# EAGLE design untitled (EAGLE 9.2.2)
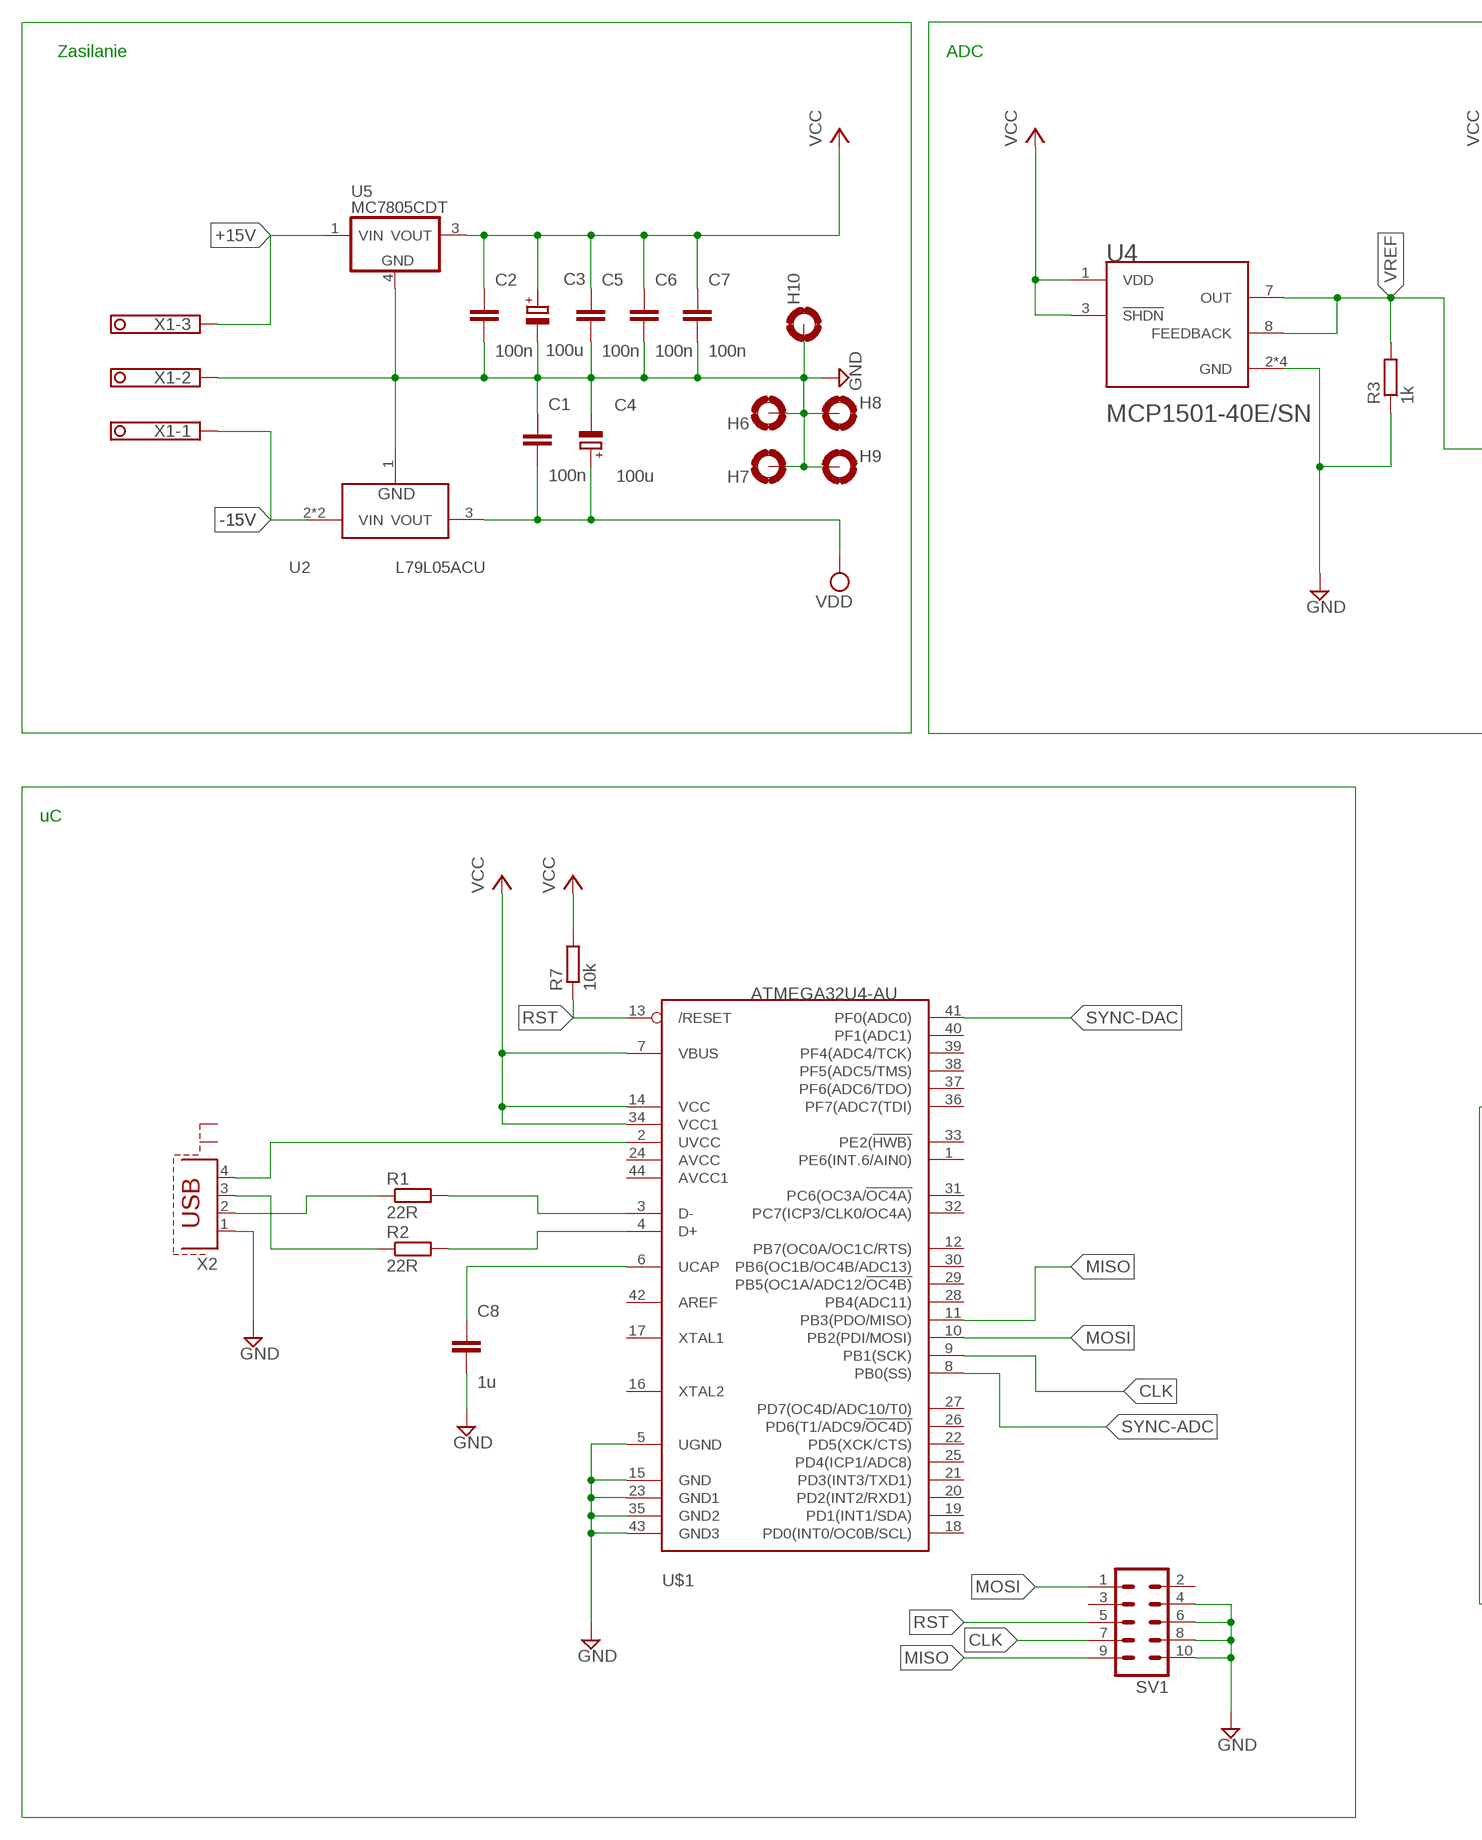
[diagram p0: schematic, sheet 1, part 1 of 2]
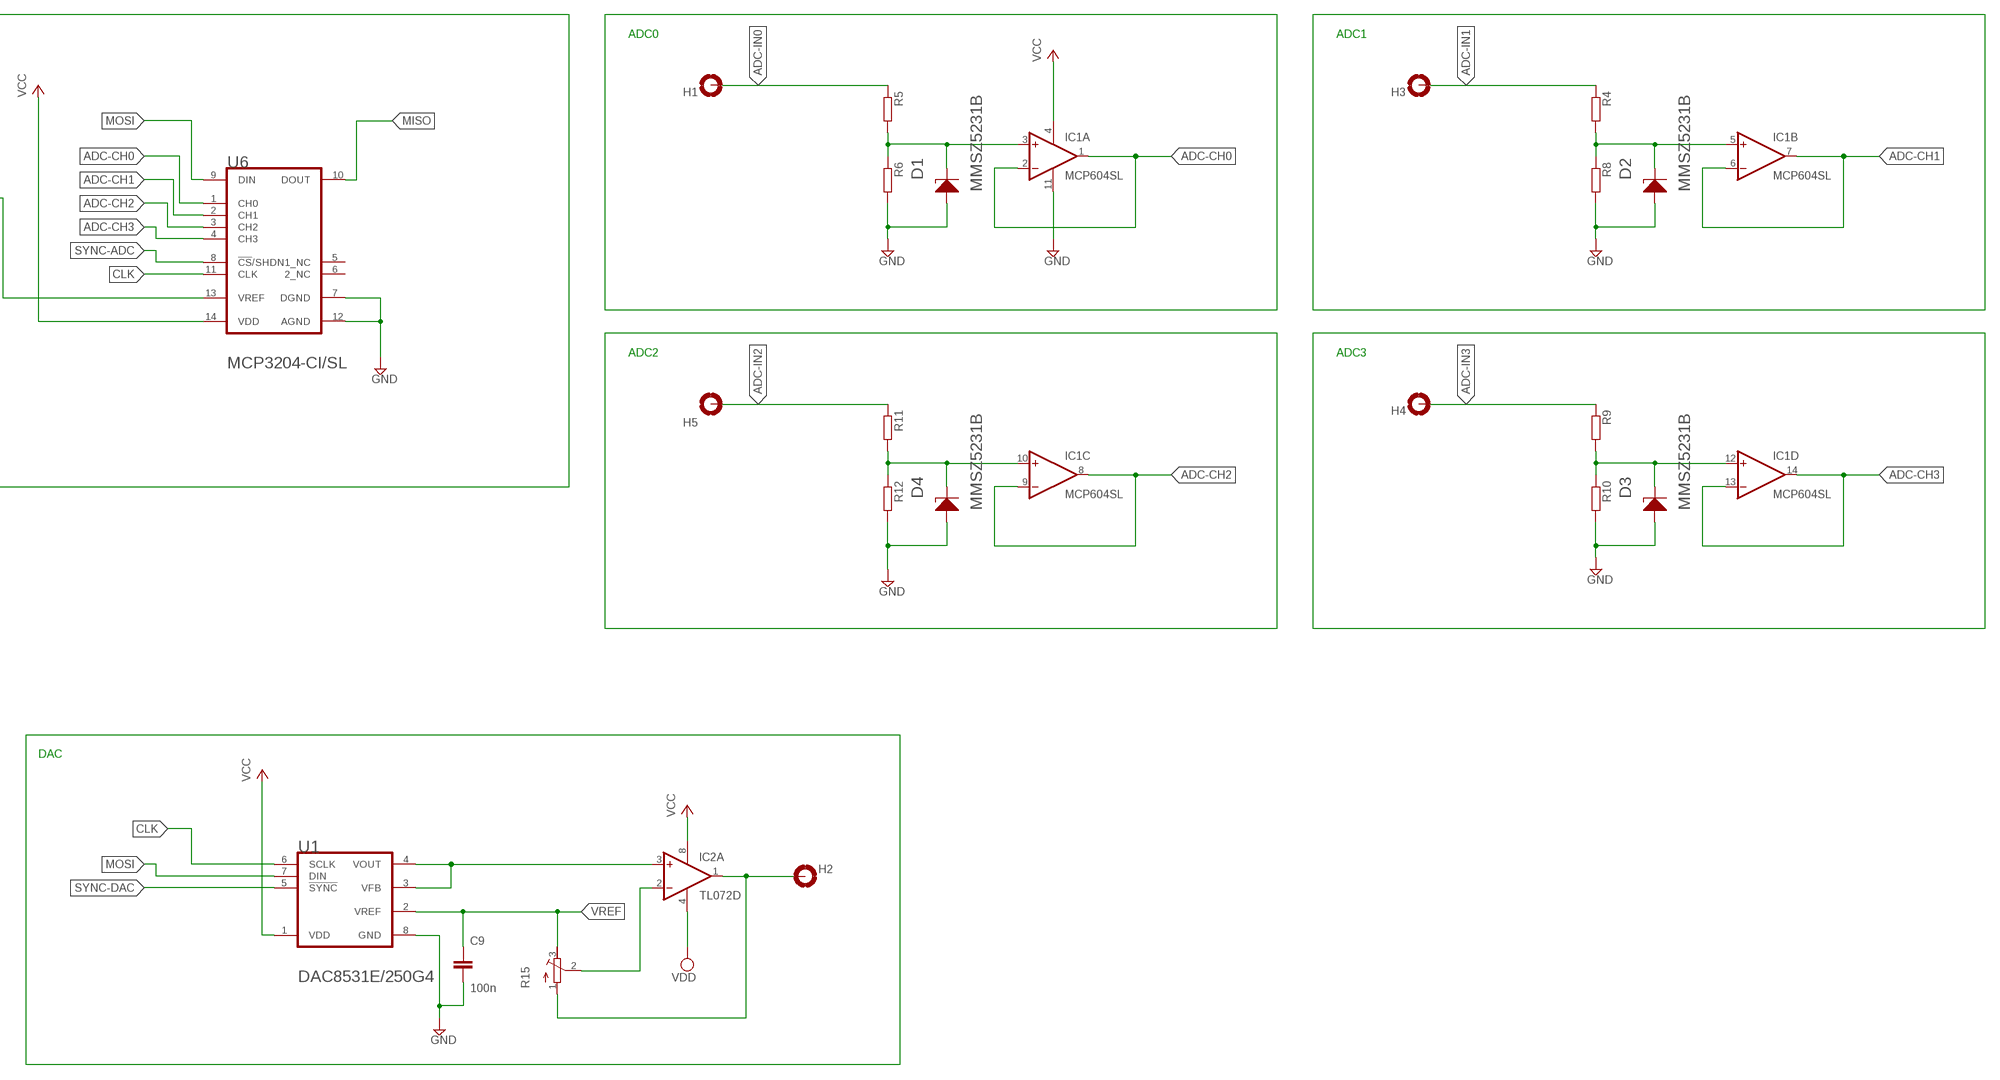
[diagram p1: schematic, sheet 1, part 2 of 2]

## Parts
C1  100n  C-EUC0805K  [C0805K]
C2  100n  C-EUC0805K  [C0805K]
C3  100u  CPOL-EU153CLV-1014  [153CLV-1014]
C4  100u  CPOL-EU153CLV-1014  [153CLV-1014]
C5  100n  C-EUC0805K  [C0805K]
C6  100n  C-EUC0805K  [C0805K]
C7  100n  C-EUC0805K  [C0805K]
C8  1u  C-EUC0805K  [C0805K]
C9  100n  C-EUC0805K  [C0805K]
D1  MMSZ5231BVISHAY_SEMICONDUCTOR_MMSZ5231B-E3-08_0_0  [VISHAY_SEMICONDUCTOR_MMSZ5231B-E3-08_0]
D2  MMSZ5231BVISHAY_SEMICONDUCTOR_MMSZ5231B-E3-08_0_0  [VISHAY_SEMICONDUCTOR_MMSZ5231B-E3-08_0]
D3  MMSZ5231BVISHAY_SEMICONDUCTOR_MMSZ5231B-E3-08_0_0  [VISHAY_SEMICONDUCTOR_MMSZ5231B-E3-08_0]
D4  MMSZ5231BVISHAY_SEMICONDUCTOR_MMSZ5231B-E3-08_0_0  [VISHAY_SEMICONDUCTOR_MMSZ5231B-E3-08_0]
H1  MOUNT-PAD-ROUND2.8  [2,8-PAD]
H2  MOUNT-PAD-ROUND2.8  [2,8-PAD]
H3  MOUNT-PAD-ROUND2.8  [2,8-PAD]
H4  MOUNT-PAD-ROUND2.8  [2,8-PAD]
H5  MOUNT-PAD-ROUND2.8  [2,8-PAD]
H6  MOUNT-PAD-ROUND2.8  [2,8-PAD]
H7  MOUNT-PAD-ROUND2.8  [2,8-PAD]
H8  MOUNT-PAD-ROUND2.8  [2,8-PAD]
H9  MOUNT-PAD-ROUND2.8  [2,8-PAD]
H10  MOUNT-PAD-ROUND2.8  [2,8-PAD]
IC1  MCP604SL  [SO14]
IC2  TL072D  [SO08]
R1  22R  R-EU_R1206  [R1206]
R2  22R  R-EU_R1206  [R1206]
R3  1k  R-EU_M1206  [M1206]
R4  R-EU_M1206  [M1206]
R5  R-EU_M1206  [M1206]
R6  R-EU_M1206  [M1206]
R7  10k  R-EU_M1206  [M1206]
R8  R-EU_M1206  [M1206]
R9  R-EU_M1206  [M1206]
R10  R-EU_M1206  [M1206]
R11  R-EU_M1206  [M1206]
R12  R-EU_M1206  [M1206]
R15  R-TRIMM64Y  [RTRIM64Y]
SV1  ML10  [ML10]
U1  TEXAS_INSTRUMENTS_DAC8531E-250G4TEXAS_INSTRUMENTS_DAC8531E-250G4_0_0  [TEXAS_INSTRUMENTS_DAC8531E-250G4_0]
U2  L79L05ACUTRL79L05ACU  [L79L05ACUTR_1]
U4  MCP1501-40E/SN  [SOIC127P600X175-8N]
U5  MC7805CDT  [DPAK-3]
U6  MCP3204-CI-SL  [SO14]
U$1  ATMEGA32U4-AU  [TQFP44]
X1  1751251  [1751251]
X2  PN61729-S  [PN61729-S]

## Nets
+15V: U5.1(VIN) X1.3
-15V: U2.2(VIN) U2.2-2(VIN) X1.1
ADC-CH0: IC1.1(A:OUT) IC1.2(A:-IN) U6.1(CH0)
ADC-CH1: IC1.6(B:-IN) IC1.7(B:OUT) U6.2(CH1)
ADC-CH2: IC1.8(C:OUT) IC1.9(C:-IN) U6.3(CH2)
ADC-CH3: IC1.13(D:-IN) IC1.14(D:OUT) U6.4(CH3)
ADC-IN0: H1.B2,8(MOUNT) R5.1
ADC-IN1: H3.B2,8(MOUNT) R4.1
ADC-IN2: H5.B2,8(MOUNT) R11.1
ADC-IN3: H4.B2,8(MOUNT) R9.1
CLK: SV1.7 U1.6(SCLK) U6.11(CLK) U$1.9(PB1(SCK))
GND: C1.1 C2.2 C3.- C4.- C5.2 C6.2 C7.2 C8.2 C9.2 D1.1(A) D2.1(A) D3.1(A) D4.1(A) H6.B2,8(MOUNT) H7.B2,8(MOUNT) H8.B2,8(MOUNT) H9.B2,8(MOUNT) H10.B2,8(MOUNT) IC1.11(P:V-) R3.1 R6.2 R8.2 R10.2 R12.2 SV1.4 SV1.6 SV1.8 SV1.10 U1.8(GND) U2.1(GND) U4.2(GND) U4.4(GND) U4.5(GND) U4.6(GND) U5.4(GND) U6.7(DGND) U6.12(AGND) U$1.5(UGND) U$1.15(GND) U$1.23(GND1) U$1.35(GND2) U$1.43(GND3) X1.2 X2.1
MISO: SV1.9 U6.10(DOUT) U$1.11(PB3(PDO/MISO))
MOSI: SV1.1 U1.7(DIN) U6.9(DIN) U$1.10(PB2(PDI/MOSI))
N$1: R1.1 X2.2
N$2: R1.2 U$1.3(D-)
N$3: R2.1 X2.3
N$4: R2.2 U$1.4(D+)
N$6: H2.B2,8(MOUNT) IC2.1(A:OUT) R15.1(A)
N$8: U$1.2(UVCC) X2.4
N$10: D2.2(K) IC1.5(B:+IN) R4.2 R8.1
N$11: D1.2(K) IC1.3(A:+IN) R5.2 R6.1
N$14: C8.1 U$1.6(UCAP)
N$16: D3.2(K) IC1.12(D:+IN) R9.2 R10.1
N$17: IC2.3(A:+IN) U1.3(VFB) U1.4(VOUT)
N$19: D4.2(K) IC1.10(C:+IN) R11.2 R12.1
N$22: IC2.2(A:-IN) R15.2(S)
RST: R7.1 SV1.5 U$1.13(/RESET)
SYNC-ADC: U6.8(!CS!/SHDN) U$1.8(PB0(SS))
SYNC-DAC: U1.5(!SYNC!) U$1.41(PF0(ADC0))
VCC: C2.1 C3.+ C5.1 C6.1 C7.1 IC1.4(P:V+) IC2.8(P:V+) R7.2 U1.1(VDD) U4.1(VDD) U4.3(!SHDN) U5.3(VOUT) U6.14(VDD) U$1.7(VBUS) U$1.14(VCC) U$1.34(VCC1)
VDD: C1.2 C4.+ IC2.4(P:V-) U2.3(VOUT)
VREF: C9.1 R3.2 R15.3(E) U1.2(VREF) U4.7(OUT) U4.8(FEEDBACK) U6.13(VREF)
Unconnected: IC2.5(B:+IN) IC2.6(B:-IN) IC2.7(B:OUT) SV1.2 SV1.3 U6.5(1_NC) U6.6(2_NC) U$1.1(PE6(INT.6/AIN0)) U$1.12(PB7(OC0A/OC1C/RTS)) U$1.16(XTAL2) U$1.17(XTAL1) U$1.18(PD0(INT0/OC0B/SCL)) U$1.19(PD1(INT1/SDA)) U$1.20(PD2(INT2/RXD1)) U$1.21(PD3(INT3/TXD1)) U$1.22(PD5(XCK/CTS)) U$1.24(AVCC) U$1.25(PD4(ICP1/ADC8)) U$1.26(PD6(T1/ADC9/!OC4D)) U$1.27(PD7(OC4D/ADC10/T0)) U$1.28(PB4(ADC11)) U$1.29(PB5(OC1A/ADC12/!OC4B)) U$1.30(PB6(OC1B/OC4B/ADC13)) U$1.31(PC6(OC3A/!OC4A)) U$1.32(PC7(ICP3/CLK0/OC4A)) U$1.33(PE2(!HWB)) U$1.36(PF7(ADC7(TDI)) U$1.37(PF6(ADC6/TDO)) U$1.38(PF5(ADC5/TMS)) U$1.39(PF4(ADC4/TCK)) U$1.40(PF1(ADC1)) U$1.42(AREF) U$1.44(AVCC1) X2.S1 X2.S2

## Notes on the sheet
- Zasilanie | ADC | ADC0 | ADC1
- ADC2 | ADC3
- uC
- DAC

## Library data of the parts
C1 C2 C5-C9 = rcl:C-EU: CAPACITOR, European symbol; SPICEPREFIX: C
C3 C4 = rcl:CPOL-EU: POLARIZED CAPACITOR, European symbol; SPICEPREFIX: C
D1-D4 = Vishay Semiconductor - MMSZ5231B-E3-08:MMSZ5231B: VISH-DZEN_A1K2-2; CIIVA_IDS: 12577312; COMPONENT_LINK_1_DESCRIPTION: Manufacturer URL; COMPONENT_LINK_1_URL: http://www.vishay.com/; COMPONENT_LINK_3_DESCRIPTION: Package Specification; COMPONENT_LINK_3_URL: http://www.vishay.com/docs/85774/mmsz5225.pdf; DATASHEET: http://www.vishay.com/docs/85774/mmsz5225.pdf; DATASHEET_VERSION: Rev. 1.9; FOOTPRINT_VARIANT_NAME_0: Manufacturer Recommended; IMPORTED: yes; IMPORTED_FROM: vault; IMPORT_TS: 1521847379; INT_CONSTRUCTION: Single; MF: Vishay Semiconductor; MOUNTING_TECHNOLOGY: Surface Mount; MPN: MMSZ5231B-E3-08; OPERATING_TEMPERATURE: -55 to 150 degC; PACKAGE: SOD-123-2; PACKAGE_DESCRIPTION: 2-Pin SMD, Body 2.7 x 1.55 mm, Height 1.35 mm; PACKAGE_VERSION: Rev. 1.9; PACKING: Tape and Reel; POWER_DISSIPATION_MW: 500; PREFIX: D; RELEASE_DATE: 1397630548; ROHS: Yes; TEST_CURRENT_IZT1_MA: 20; TOLERANCE: +/- 5%; VAULT_GUID: 70607D0E-7B6F-4C54-B07D-74F6430C889F; VAULT_REVISION: 64578FB9-B48E-4508-8668-FC036D1DEE8C; ZENER_IMPEDANCE_IZT1_MAX_OHM: 17; ZENER_VOLTAGE_NOM_V: 5.1
H1-H10 = holes:MOUNT-PAD-ROUND: MOUNTING PAD, round
IC1 = linear:MCP604: Quad Op Amp 2.7V to 6.0V Single Supply CMOS Source: http://ww1.microchip.com/downloads/en/DeviceDoc/21314g.pdf
IC2 = linear:TL072: OP AMP; SPICEPREFIX: J
R1-R12 = rcl:R-EU_: RESISTOR, European symbol; SPICEPREFIX: R
R15 = rcl-moja:R-TRIMM: Trimm resistor; SPICEMODEL: X; SPICEPREFIXL: POT
SV1 = con-harting-ml:ML10: HARTING; OC_FARNELL: unknown; OC_NEWARK: unknown
U1 = 250G4:TEXAS_INSTRUMENTS_DAC8531E-250G4: TI-DAC85XX_7513DGK8; CIIVA_IDS: 1105656; CODE__JEDEC: MO-187; COMPONENT_LINK_1_DESCRIPTION: Manufacturer URL; COMPONENT_LINK_1_URL: http://www.ti.com/; COMPONENT_LINK_3_DESCRIPTION: Package Specification; COMPONENT_LINK_3_URL: http://www.ti.com/litv/pdf/mpds028d; DAC_CHANNELS: 1; DATASHEET: http://www.ti.com/general/docs/lit/getliterature.tsp?genericPartNumber=DAC8531&fileType=pdf; DATASHEET_VERSION: SBAS192B; DNL_MAX__LSB: 1; FOOTPRINT_VARIANT_NAME_0: Level C; FOOTPRINT_VARIANT_NAME_1: Level B; FOOTPRINT_VARIANT_NAME_2: Level A; IMPORTED: yes; IMPORTED_FROM: vault; IMPORT_TS: 1521848603; INL_MAX__LSB: 64; INTERFACE: Serial SPI; MF: Texas Instruments; MOUNTING_TECHNOLOGY: Surface Mount; MPN: DAC8531E/250G4; PACKAGE: DGK8; PACKAGE_DESCRIPTION: 8-Pin Thin Small Outline, Body 3 x 3 mm, Pitch 0.65 mm; PACKAGE_VERSION: 4073329/E, 05/2006; POWER_CONSUMPTIONTYPMW: 0.72; PREFIX: U; RELEASE_DATE: 1386907195; RESOLUTION_BITS: 16; ROHS: Yes; SETTLING_TIMEUS: 10; SUB_FAMILY: Precision DAC (=<10MSPS); VAULT_GUID: 24C4D2D2-79FE-463F-949A-47BEEBD06B87; VAULT_REVISION: 5D71E3C2-3523-4A82-88B7-3E6F167E22E1
U2 = STMicroelectronics - L79L05ACUTR:L79L05ACUTR: PM-REG-7905-SIL3A; CIIVA_IDS: 1170802; COMPONENT_LINK_1_DESCRIPTION: Manufacturer URL; COMPONENT_LINK_1_URL: http://www.st.com; DATASHEET: http://www.st.com/internet/com/TECHNICAL_RESOURCES/TECHNICAL_LITERATURE/DATASHEET/CD00000539.pdf; DATASHEET_VERSION: 1/07/2009; FOOTPRINT_VARIANT_NAME_0: Level C; FOOTPRINT_VARIANT_NAME_1: Level B; FOOTPRINT_VARIANT_NAME_2: Level A; IMPORTED: yes; IMPORTED_FROM: vault; IMPORT_TS: 1521844519; MF: STMicroelectronics; MPN: L79L05ACUTR; PACKAGE: SOT-89; PACKAGE_DESCRIPTION: 3-Pin SOT-89 Package 1.5 mm Pitch, 4.1 mm Lead Span; PACKAGE_VERSION: 2011; PREFIX: U; RELEASE_DATE: 1329882115; SPICEPREFIX: U; VAULT_GUID: B2A9B761-E684-4613-9EB3-0BF5D2F36EDE; VAULT_REVISION: E3501EF4-AECA-4061-81D6-FD8198A838F4
U4 = MCP1501-40E_SN:MCP1501-40E/SN: High Precision Buffered Voltage Reference; AVAILABILITY: Unavailable; DESCRIPTION: High Precision Buffered Voltage Reference; MF: Microchip; MP: MCP1501-40E/SN; PACKAGE: SOIC-8 Microchip; PRICE: None
U5 = _hhn_78xx_79xx_NCV78xx_d2pak_dpak:MC78*: 78xx SMD (D2PAK, DPAK) (MC)78xx..DT (DPAK-3; Rth,JA = 92 K/W) (MC)78xx..D2T (D2PAK-3; Rth,JA = 45 K/W @ 10x10mm copper area) Linear Voltage Regulators, Positive, 1 A (ON Semiconductor) Package dimenisions and soldering footprints acc. to ONSEMI specs. Source: http://onsemi.com Datasheet document#: MC7800/D Technologies: 78xxyD(2)Tz: xx = Output Voltage (V) y, z: additional suffixes see manufacturer's datasheet Author: Dipl.-Ing. FH Rainer Bayer HHN Hochschule Heilbronn, rainer.bayer@hs-heilbronn.de Ingenieurbüro ing-rb, mail@ing-rb.de
U6 = SL:MCP3204-CI-SL: CON-ADC-MCP3004-14
U$1 = adafruit:ATMEGA32U4: http://www.ladyada.net/library/eagle
X1 = con-phoenix-350:1751251: MKDS 1/ 3-3,5 Printklemme Nennstrom: 10 A Bemessungsspannung: 160 V Raster: 3,5 mm Polzahl: 3 Montageart: Löten Anschlussart: Schraubanschluss Anschlussrichtung vom Leiter zur Platine: 0° Source: http://eshop.phoenixcontact.com .. 1751251.pdf; OC_FARNELL: unknown; OC_NEWARK: unknown
X2 = con-berg:PN61729-S: BERG USB connector; OC_FARNELL: unknown; OC_NEWARK: unknown

## Board
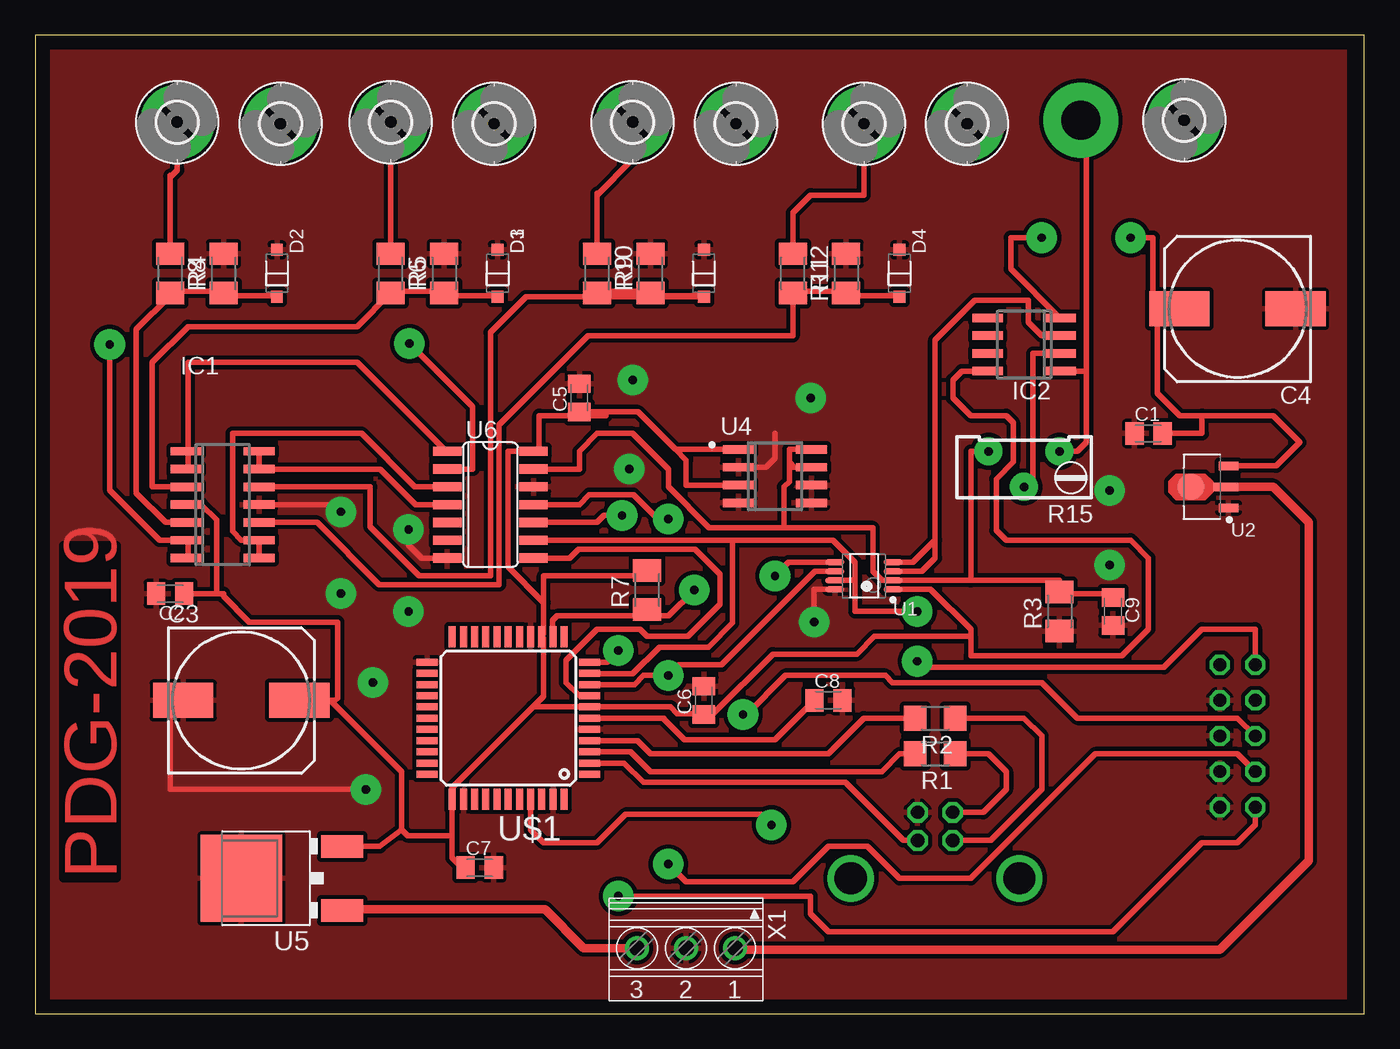
[diagram p2: board, top side]
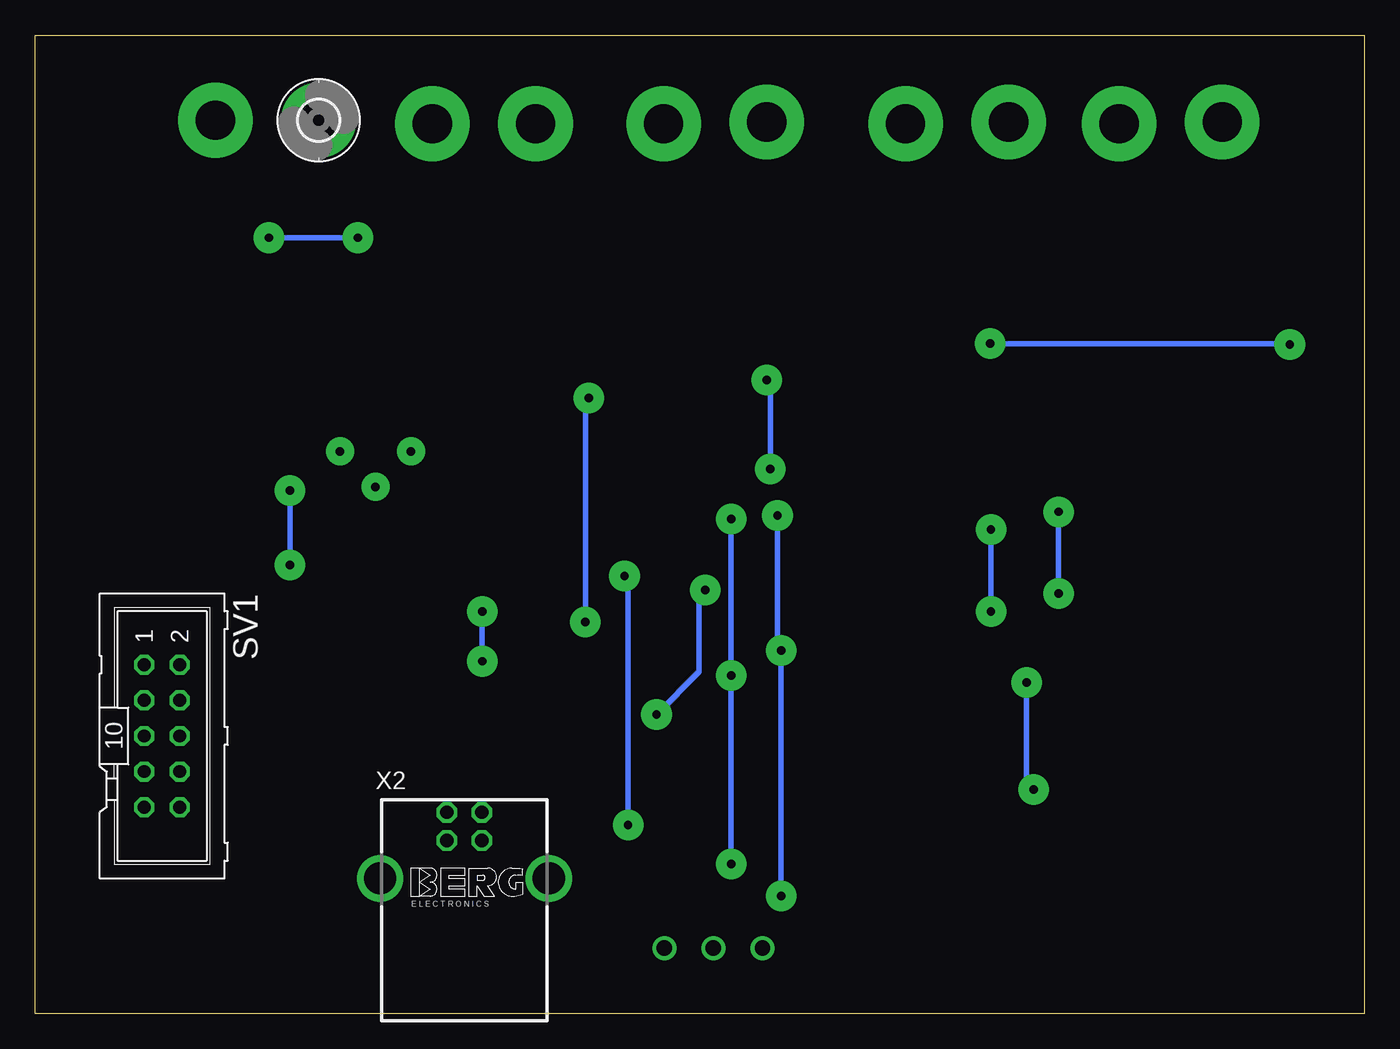
[diagram p3: board, bottom side, seen from below]

Size 94.92 x 69.84 mm. Coordinates in mm from the lower left corner, seen from the top.
Outline: 0,0 94.92,0 94.92,69.84 0,69.84 0,0
Copper layers (1*16): Top 0.035mm / dielectric 1.5mm / Bottom 0.035mm
Design rules "default *": minimum track width 16mil, minimum drill 0.5mm, track to track 6mil, track to pad 6mil, pad to pad 6mil, via to via 6mil, smd to smd 6mil, copper to edge 40mil, drill to drill 6mil, minimum pad ring 10mil, minimum via ring 8mil, stop-mask expansion 4mil, vias tented up to drill 0mil, thermal gap 10mil

### Footprints (pad centres in the part's own frame; a part is rotated, then mirrored left to right if it is on the bottom)
C0805K = smd 1.3 x 1.6: 1 -1,0; 2 1,0
153CLV-1014 = smd 4.3 x 2.5: + 4.15,0; - -4.15,0
VISHAY_SEMICONDUCTOR_MMSZ5231B-E3-08_0 = smd 0.85 x 0.85: 1 -1.675,0; 2 1.675,0
2,8-PAD = drill 2.8 pad 5.334: B2,8 0,0
SO14 = smd 0.6 x 2.2: 1 -3.81,-2.6; 2 -2.54,-2.6; 3 -1.27,-2.6; 4 0,-2.6; 5 1.27,-2.6; 6 2.54,-2.6; 7 3.81,-2.6; 8 3.81,2.6; 9 2.54,2.6; 10 1.27,2.6; 11 0,2.6; 12 -1.27,2.6; 13 -2.54,2.6; 14 -3.81,2.6
SO08 = smd 0.6 x 2.2: 1 -1.905,-2.6; 2 -0.635,-2.6; 3 0.635,-2.6; 4 1.905,-2.6; 5 1.905,2.6; 6 0.635,2.6; 7 -0.635,2.6; 8 -1.905,2.6
R1206 = smd 1.6 x 1.803: 1 -1.422,0; 2 1.422,0
M1206 = smd 1.6 x 2: 1 -1.4,0; 2 1.4,0
RTRIM64Y = drill 0.61 pad 2: 1 0,-2.54; 3 0,2.54 | drill 0.6 pad 2: 2 -2.54,0
ML10 = drill 0.914 octagon: 1 -5.08,-1.27; 2 -5.08,1.27; 3 -2.54,-1.27; 4 -2.54,1.27; 5 0,-1.27; 6 0,1.27; 7 2.54,-1.27; 8 2.54,1.27; 9 5.08,-1.27; 10 5.08,1.27
TEXAS_INSTRUMENTS_DAC8531E-250G4_0 = smd 1.35 x 0.426: 1 -2.075,0.975; 2 -2.075,0.325; 3 -2.075,-0.325; 4 -2.075,-0.975; 5 2.075,-0.975; 6 2.075,-0.325; 7 2.075,0.325; 8 2.075,0.975
L79L05ACUTR_1 = smd 1.4 x 0.6: 1 -1.9,1.5; 3 -1.9,-1.5 | smd 1.8 x 0.6: 2 -1.7,0 | smd 1.9 x 1.9: 2-2 0.8,0
SOIC127P600X175-8N = smd 2.2 x 0.6: 1 -2.6,1.905; 2 -2.6,0.635; 3 -2.6,-0.635; 4 -2.6,-1.905; 5 2.6,-1.905; 6 2.6,-0.635; 7 2.6,0.635; 8 2.6,1.905
DPAK-3 = smd 1.6 x 3: 1 -2.286,-7.18; 3 2.286,-7.18 | smd 6.2 x 5.8: 4 0,0
SO14' = smd 0.66 x 2.032: 1 -3.81,-3.073; 2 -2.54,-3.073; 3 -1.27,-3.073; 4 0,-3.073; 5 1.27,-3.073; 6 2.54,-3.073; 7 3.81,-3.073; 8 3.81,3.073; 9 2.54,3.073; 10 1.27,3.073; 11 0,3.073; 12 -1.27,3.073; 13 -2.54,3.073; 14 -3.81,3.073
TQFP44 = smd 1.5 x 0.5: 1 -5.8,4; 2 -5.8,3.2; 3 -5.8,2.4; 4 -5.8,1.6; 5 -5.8,0.8; 6 -5.8,0; 7 -5.8,-0.8; 8 -5.8,-1.6; 9 -5.8,-2.4; 10 -5.8,-3.2; 11 -5.8,-4; 23 5.8,-4; 24 5.8,-3.2; 25 5.8,-2.4; 26 5.8,-1.6; 27 5.8,-0.8; 28 5.8,0; 29 5.8,0.8; 30 5.8,1.6; 31 5.8,2.4; 32 5.8,3.2; 33 5.8,4 | smd 0.5 x 1.5: 12 -4,-5.8; 13 -3.2,-5.8; 14 -2.4,-5.8; 15 -1.6,-5.8; 16 -0.8,-5.8; 17 0,-5.8; 18 0.8,-5.8; 19 1.6,-5.8; 20 2.4,-5.8; 21 3.2,-5.8; 22 4,-5.8; 34 4,5.8; 35 3.2,5.8; 36 2.4,5.8; 37 1.6,5.8; 38 0.8,5.8; 39 0,5.8; 40 -0.8,5.8; 41 -1.6,5.8; 42 -2.4,5.8; 43 -3.2,5.8; 44 -4,5.8
1751251 = drill 1.1 pad 1.7: 1 -3.5,-0.1; 2 0,-0.1; 3 3.5,-0.1
PN61729-S = drill 0.95 octagon: 1 1.25,4.71; 2 -1.25,4.71; 3 -1.25,2.71; 4 1.25,2.71 | drill 2.3 pad 2.9: S1 -6.02,0; S2 6.02,0

### Placement (x,y rotation side)
C1  79.5,41.4 0 top
C2  9.65,29.97 180 top
C3  14.73,22.35 0 top
C4  85.85,50.29 180 top
C5  38.86,43.94 90 top
C6  47.75,22.35 90 top
C7  31.75,10.41 0 top
C8  56.64,22.35 0 top
C9  76.96,28.7 270 top
D1  33.02,52.83 270 top
D2  17.27,52.83 270 top
D3  47.75,52.83 270 top
D4  61.72,52.83 270 top
H1  25.4,63.63 0 top
H2  74.68,63.75 0 bottom
H3  10.16,63.63 0 top
H4  42.67,63.63 0 top
H5  59.18,63.5 0 top
H6  82.04,63.75 0 top
H7  17.53,63.5 0 top
H8  32.77,63.5 0 top
H9  50.04,63.5 0 top
H10  66.55,63.5 0 top
IC1  13.4,36.32 270 top
IC2  70.61,47.75 90 top
R1  64.26,18.54 180 top
R2  64.26,21.08 180 top
R3  73.15,28.7 90 top
R4  9.65,52.83 270 top
R5  25.4,52.83 270 top
R6  29.21,52.83 90 top
R7  43.69,30.23 90 top
R8  13.46,52.83 90 top
R9  40.13,52.83 270 top
R10  43.94,52.83 90 top
R11  54.1,52.83 270 top
R12  57.91,52.83 90 top
R15  70.61,40.13 90 top
SV1  85.85,19.81 270 bottom
U1  59.18,31.24 180 top
U2  83.31,37.59 180 top
U4  52.83,38.35 0 top
U5  14.73,9.65 90 top
U6  MCP3204-CI-SL  [SO14']  32.51,36.32 270 top
U$1  33.78,21.08 180 top
X1  46.48,4.57 180 top
X2  64.26,9.65 0 bottom

### Tracks (layer width: path | path; a pad name or v marks a point on that pad's centre or on a via)
+15V
  Top 0.406: U5.1 21.98,7.43
  Top 0.61: 21.98,7.43 36.41,7.43 39.17,4.67 X1.3
-15V
  Top 0.406: U2.2-2 U2.2 | X1.1 50.2,4.89
  Top 0.61: X1.1 50.08,4.57 84.58,4.57 90.93,10.92 90.93,35.05 88.39,37.59 U2.2
ADC-CH0
  Top 0.406: 10.92,40.13 10.92,46.48 22.99,46.48 29.34,40.13 U6.1 | 10.92,40.13 10.92,38.86 IC1.2 | 10.92,40.13 IC1.1
ADC-CH1  (via drill 0.6 pad 2.18)
  Top 0.406: U6.2 31.24,38.86 31.24,43.31 v26.73,47.82 26.92,48.01 | v5.33,47.75 5.33,37.34 8.89,33.78 IC1.6 10.92,33.78 10.92,32.51 IC1.7
  Bottom 0.406: v26.73,47.82 5.4,47.82 v5.33,47.75
ADC-CH2
  Top 0.406: U6.3 27.11,37.59 23.3,41.4 14.1,41.4 14.1,34.42 14.73,33.78 IC1.9 IC1.8
ADC-CH3
  Top 0.406: U6.4 27.18,36.32 24.64,38.86 IC1.13 IC1.14
ADC-IN0
  Top 0.406: H1.B2,8 R5.1
ADC-IN1
  Top 0.406: 9.65,59.69 R4.1 | 9.65,59.69 9.65,59.82 | 9.65,59.69 10.16,60.2 H3.B2,8
ADC-IN2
  Top 0.406: R11.1 54.1,57.15 55.37,58.42 59.18,58.42 H5.B2,8
ADC-IN3
  Top 0.406: 40.13,58.55 40.13,58.42 | 40.13,58.42 R9.1 | 40.13,58.42 42.67,60.96 H4.B2,8
CLK  (via drill 0.6 pad 2.18)
  Top 0.406: U$1.9 42.81,23.48 43.46,24.13 v45.21,24.13 45.97,24.89 49.02,24.89 55.7,31.57 U1.6 | v45.21,35.31 44.45,35.31 42.72,37.03 39.57,37.03 38.86,36.32 U6.11 | SV1.7 85.85,18.54 75.69,18.54 66.8,9.65 61.72,9.65 59.44,11.94 56.64,11.94 54.1,9.4 46.48,9.4 v45.21,10.67
  Bottom 0.406: v45.21,35.31 v45.21,24.13 v45.21,10.67
GND  (via drill 0.6 pad 2.18)
  Top 0.406: U1.8 55.63,30.27 v55.63,27.94 | U4.2 52.2,38.99 52.83,39.62 52.83,41.4 | 76.96,37.59 v76.71,37.34 | U6.7 27.59,32.51 26.67,33.43 v26.67,34.54 | v21.84,35.81 21.59,35.81 21.08,36.32 IC1.11 | v21.84,29.97 22.35,29.97 | C3.- 9.65,21.42 9.65,16 v23.62,16
  Bottom 0.406: v55.37,43.94 55.63,43.69 v55.63,27.94 | v42.42,38.86 42.42,44.96 v42.67,45.21 | v76.71,32 v76.71,37.34 | v26.67,34.54 v26.67,28.7 | v21.84,35.81 v21.84,29.97 | v24.13,23.62 24.13,16.51 v23.62,16
  pour Top (isolate 0.305): 0.76,69.34 93.47,69.34 93.47,0.76 0.76,0.76
MISO  (via drill 0.6 pad 2.18)
  Top 0.406: U$1.11 40.83,25.08 v41.66,25.91 | U6.10 40.13,35.05 40.64,35.56 v41.91,35.56 | v41.66,8.38 55.37,8.38 55.37,7.11 56.64,5.84 76.96,5.84 83.31,12.19 85.85,12.19 87.12,13.46 SV1.9
  Bottom 0.406: v41.91,35.56 41.91,26.16 v41.66,25.91 v41.66,8.38
MOSI  (via drill 0.6 pad 2.18)
  Top 0.406: 58.55,30.92 57.91,30.92 57.9,30.92 U1.7 | 58.55,30.92 58.55,32.19 56.96,33.78 49.78,33.78 | U6.9 49.78,33.78 | 49.78,33.78 49.78,27.88 48.07,26.16 44.58,26.16 42.67,24.26 39.81,24.26 U$1.10 | 58.55,30.92 58.55,28.7 v62.99,28.7 | v62.99,25.15 63.42,24.71 80.59,24.71 83.31,27.43 87.12,27.43 SV1.1
  Bottom 0.406: v62.99,28.7 v62.99,25.15
N$1
  Top 0.406: R1.1 68.07,18.54 69.34,17.27 69.34,16 67.7,14.36 X2.2
N$2
  Top 0.406: U$1.3 42.53,18.68 43.94,17.27 60.45,17.27 61.72,18.54 R1.2
N$3
  Top 0.406: X2.3 68.24,12.36 71.88,16 71.88,19.81 70.61,21.08 R2.1
N$4
  Top 0.406: U$1.4 43,19.48 43.94,18.54 56.64,18.54 59.18,21.08 R2.2
N$6
  Top 0.406: 73.15,45.85 IC2.1 75.06,45.85 | 75.06,45.85 75.06,63.31 74.74,63.63 H2.B2,8 | 75.06,45.85 75.06,40.77 74.42,40.13 R15.1
N$8
  Top 0.406: 39.81,17.91 U$1.2 42.06,17.88 43.43,16.51 57.85,16.51 62,12.36 X2.4
N$10
  Top 0.406: D2.2 17.27,51.24 13.46,51.24 R8.1 13.46,51.56 9.65,51.56 R4.2 9.65,51.24 7.24,48.83 7.24,37.15 9.34,35.05 IC1.5
N$11
  Top 0.406: D1.2 33.02,51.24 29.21,51.24 R6.1 29.21,51.56 25.4,51.56 R5.2 22.99,49.02 10.92,49.02 8.38,46.48 8.38,37.59 IC1.3
N$14
  Top 0.406: U$1.6 44.9,21.08 44.9,21.02 46.35,19.56 52.85,19.56 C8.1
N$16
  Top 0.406: R9.2 40.13,51.56 43.94,51.56 R10.1 43.94,51.24 47.75,51.24 D3.2 35.05,51.16 32.51,48.62 32.51,31.24 27.43,31.24 23.94,34.73 23.94,37.59 IC1.12
N$17
  Top 0.406: 61.4,31.56 U1.3 63.32,31.57 64.26,32.51 64.26,33.78 | IC2.3 71.88,48.39 70.93,49.34 70.93,50.93 67.12,50.93 64.26,48.07 64.26,33.78 | 61.4,32.19 U1.4 62.7,32.22 64.26,33.78
N$19
  Top 0.406: D4.2 61.72,51.24 57.91,51.24 R12.1 57.91,51.56 54.1,51.56 R11.2 54.1,48.39 39.5,48.39 33.15,42.04 33.15,30.61 24.57,30.61 20.13,35.05 IC1.10
N$22
  Top 0.406: IC2.2 71.25,47.12 71.25,38.23 R15.2
RST  (via drill 0.6 pad 2.18)
  Top 0.406: 43.69,28.38 45.23,28.38 v47.07,30.23 | 43.69,28.38 37.27,28.38 36.96,28.07 36.96,27.11 U$1.13 | 43.69,28.38 R7.1 | v50.55,21.34 50.8,21.34 53.59,24.13 60.71,24.13 61.21,23.62 71.88,23.62 74.42,21.08 85.85,21.08 SV1.5
  Bottom 0.406: v50.55,21.34 47.5,24.38 47.5,29.72 47.54,29.76 v47.07,30.23
SYNC-ADC
  Top 0.406: U6.8 38.16,32.51 38.8,33.15 47.12,33.15 48.9,31.37 48.9,29.21 46.61,26.92 43.69,26.92 43.18,27.43 40.13,27.43 37.91,25.21 37.91,23.62 38.86,22.67 39.5,22.67 U$1.8
SYNC-DAC  (via drill 0.6 pad 2.18)
  Top 0.406: U1.5 53.81,32.22 v52.83,31.24 | v52.58,13.46 51.82,14.22 42.16,14.22 40.13,12.19 36.32,12.19 35.38,13.13 U$1.41
  Bottom 0.406: v52.83,31.24 52.58,30.99 v52.58,13.46
VCC
  Top 0.406: 45.72,40.26 U4.1 | 38.86,42.67 36.01,42.67 36.01,40.45 35.69,40.13 U6.14 33.78,40.13 33.78,31.88 36.32,29.34 | 38.86,42.67 40.77,42.67 | 38.86,42.67 C5.1 43.04,42.94 45.72,40.26 | 47.75,21.4 45.85,21.4 45.36,21.88 U$1.7 35.56,21.88 | 47.75,21.4 48.42,21.4 52.67,25.65 58.67,25.65 59.94,26.92 66.8,26.92 | 47.75,21.4 C6.1 | 36.32,29.34 36.32,27.11 U$1.14 36.32,26.8 36.32,22.64 35.56,21.88 | 36.32,29.34 36.32,31.24 43.69,31.24 R7.2 | 67.75,45.85 IC2.8 66.17,45.85 65.53,45.21 65.53,43.94 66.8,42.67 69.34,42.67 69.85,42.16 69.85,39.37 68.63,38.15 68.63,34.49 69.34,33.78 78.23,33.78 79.5,32.51 79.5,27.43 77.6,25.53 66.8,25.53 66.8,26.92 | U1.1 63.8,30.27 63.94,30.29 66.8,27.43 66.8,26.92 | IC1.4 11.87,36.32 12.95,35.24 12.95,29.97 | 26.16,13.12 24.62,11.94 U5.3 | U4.3 46.48,37.72 46.48,39.5 45.72,40.26 | 35.56,21.88 35.52,21.88 | C2.1 12.95,29.97 | 12.95,29.97 13.46,29.97 13.46,29.78 15.3,27.94 21.59,27.94 21.59,22.52 21.42,22.35 C3.+ 21.08,22.35 26.16,17.27 26.16,13.12 | 29.78,12.7 U$1.34 29.78,16.1 35.56,21.88 | 29.78,12.7 29.78,11.11 30.48,10.41 C7.1 | 26.16,13.12 26.58,12.7 29.78,12.7
VDD  (via drill 0.6 pad 2.18)
  Top 0.406: 84.9,39.18 U2.3 88.62,39.09 90.3,40.77 88.39,42.67 83.31,42.67 | C4.+ 80.45,50.29 80.14,50.61 | 80.14,50.61 79.82,50.93 79.82,55.37 v78.23,55.37 | IC2.4 73.15,49.66 69.66,53.15 69.66,55.37 v71.88,55.37 | 80.14,50.61 80.14,44.26 81.72,42.67 83.31,42.67 | C1.2 83.31,41.4 83.31,42.67
  Bottom 0.406: v78.23,55.37 v71.88,55.37
VREF
  Top 0.406: 53.47,34.67 48.13,34.67 45.21,37.59 45.21,38.86 42.67,41.4 40.13,41.4 38.86,40.13 38.86,38.86 U6.13 | 53.47,34.67 53.47,37.59 53.85,37.97 53.85,39.37 | 53.85,39.37 53.85,40.26 U4.8 | 54.1,38.99 U4.7 54.23,38.99 53.85,39.37 | 66.8,30.92 73.15,30.92 R3.2 73.15,29.97 76.96,29.97 C9.1 | 66.8,30.92 61.4,30.92 U1.2 61.09,30.92 60.45,30.92 59.82,31.56 59.82,34.67 53.47,34.67 | 66.8,30.92 66.8,40.13 R15.3

### Text on the board
Top: PDG-2019